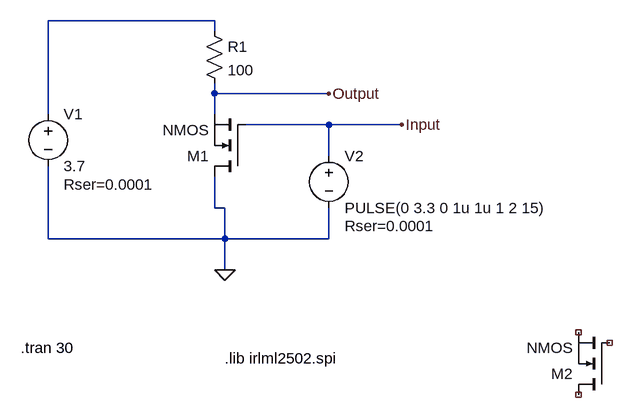
[diagram p0: schematic transistor_sim_2.asc]
transistor_sim_2.asc, the LTspice schematic file:
Version 4
SHEET 1 1180 1912
WIRE 160 -128 -96 -128
WIRE 160 -112 160 -128
WIRE 160 -16 160 -32
WIRE 336 -16 160 -16
WIRE -96 16 -96 -128
WIRE 160 16 160 -16
WIRE 336 32 208 32
WIRE 448 32 336 32
WIRE 336 80 336 32
WIRE 160 160 160 112
WIRE 176 160 160 160
WIRE -96 208 -96 96
WIRE 176 208 176 160
WIRE 176 208 -96 208
WIRE 336 208 336 160
WIRE 336 208 176 208
WIRE 176 256 176 208
FLAG 176 256 0
FLAG 336 -16 Output
FLAG 448 32 Input
SYMBOL res 144 -128 R0
SYMATTR InstName R1
SYMATTR Value 100
SYMBOL nmos 208 112 R180
SYMATTR InstName M1
SYMBOL voltage -96 0 R0
WINDOW 123 0 0 Left 0
WINDOW 39 24 124 Left 2
SYMATTR SpiceLine Rser=0.0001
SYMATTR InstName V1
SYMATTR Value 3.7
SYMBOL voltage 336 64 R0
WINDOW 123 0 0 Left 0
WINDOW 39 24 124 Left 2
SYMATTR SpiceLine Rser=0.0001
SYMATTR InstName V2
SYMATTR Value PULSE(0 3.3 0 1u 1u 1 2 15)
SYMBOL nmos 768 448 R180
SYMATTR InstName M2
TEXT -138 376 Left 2 !.tran 30
TEXT 176 392 Left 2 !.lib irlml2502.spi

The netlist it stands for:
* transistor_sim_2.asc
R1 N001 Output 100
M1 0 Input Output Output NMOS
V1 N001 0 3.7 Rser=0.0001
V2 Input 0 PULSE(0 3.3 0 1u 1u 1 2 15) Rser=0.0001
M2 NC_01 NC_02 NC_03 NC_03 NMOS
.model NMOS NMOS
.model PMOS PMOS
.lib standard.mos
.tran 30
.lib irlml2502.spi
.backanno
.end